# Altium project M2.PrjPcb
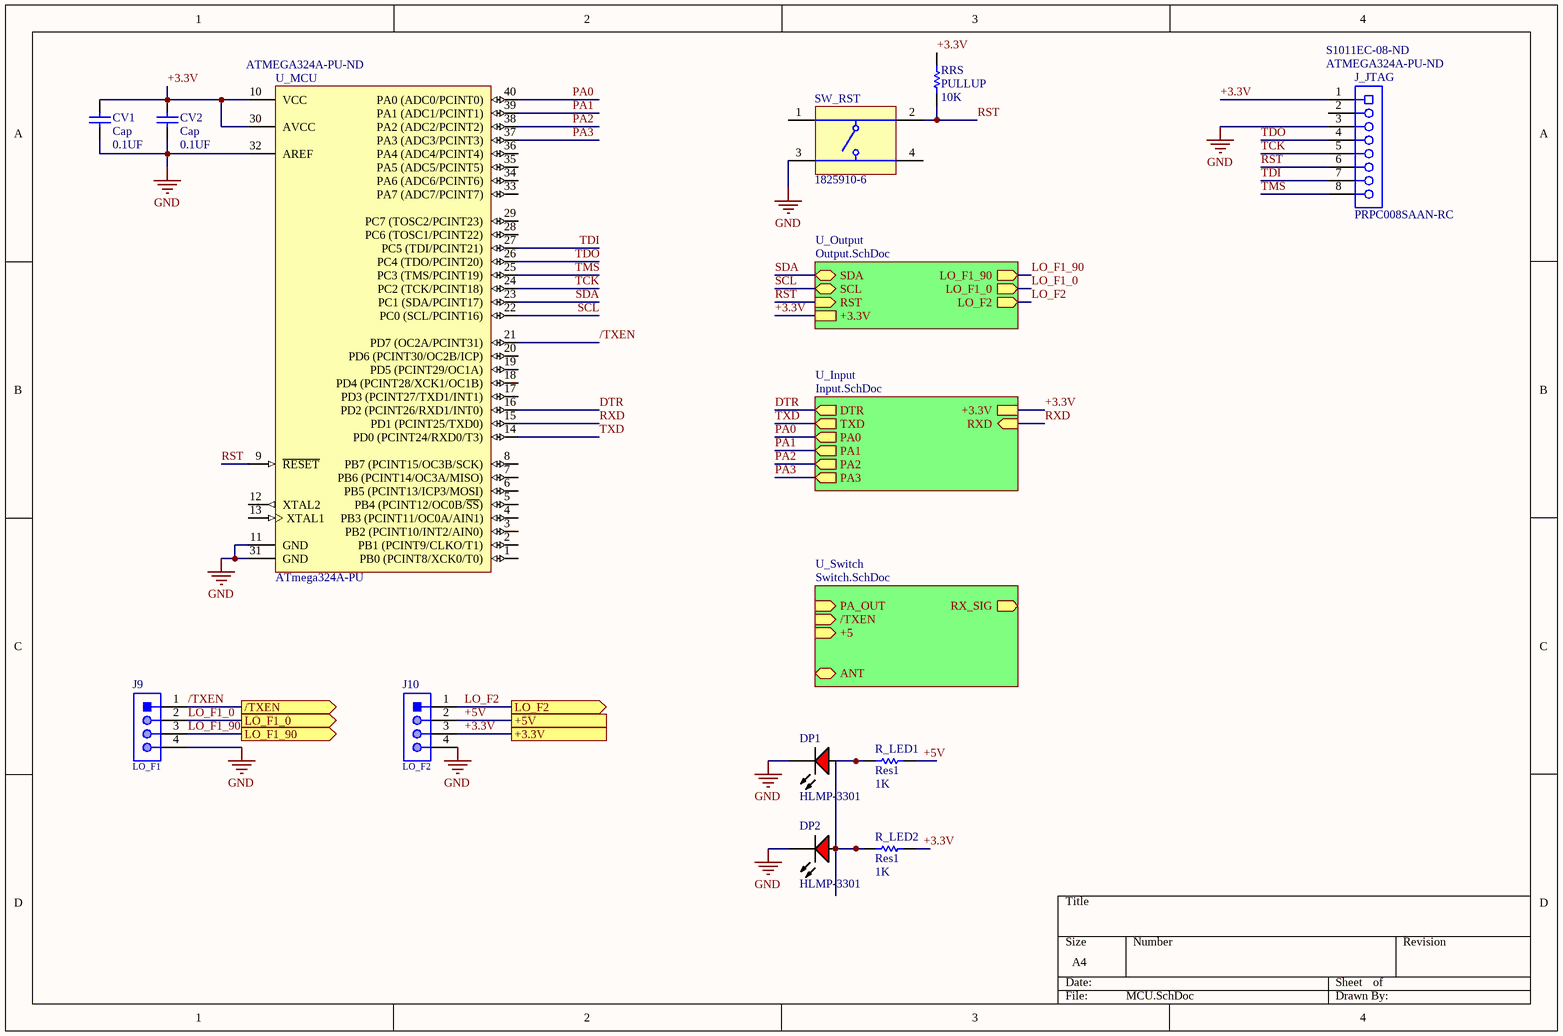
[diagram p0: MCU.SchDoc]
4 sheets, 38 parts. Net scope: hierarchical (ports join the sheet entries above them; power ports are global).
Sheets:
  MCU.SchDoc
    U_Output = Output.SchDoc
    U_Switch = Switch.SchDoc
    U_Input = Input.SchDoc

## Sheet MCU.SchDoc
size A4; SheetNumber: 1; SheetTotal: 4

### Parts
CV1  Cap  value 0.1UF  [1206]
CV2  Cap  value 0.1UF  [1206]
DP1  HLMP-3301  [AVAG-HLMP-3301-2]
DP2  HLMP-3301  [AVAG-HLMP-3301-2]
J9  LO_F1  [61300411121]
J10  LO_F2  [61300411121]
J_JTAG  PRPC008SAAN-RC  Supplier Part Number 1: ATMEGA324A-PU-ND  Supplier Part Number 2: S1011EC-08-ND  [SLIN-PPPC081LFBN-RC_V]
R_LED1  Res1  value 1K  [AXIAL-0.1-RES]
R_LED2  Res1  value 1K  [AXIAL-0.1-RES]
RRS  PULLUP  value 10K  [AXIAL-0.1-RES]
SW_RST  1825910-6  [TECO-1825910-6_V]
U_MCU  ATmega324A-PU  Supplier Part Number 1: ATMEGA324A-PU-ND  [40P6]

### Sub-sheets
U_Input = Input.SchDoc: +3.3V, DTR (out), RXD (in), TXD (out), PA0 (out), PA1 (out), PA2 (out), PA3 (out)
U_Output = Output.SchDoc: SDA (bidir), SCL (bidir), RST (in), LO_F1_90 (out), LO_F1_0 (out), LO_F2 (out), +3.3V
U_Switch = Switch.SchDoc: PA_OUT (in), ANT (bidir), /TXEN (in), +5 (in), RX_SIG (out)

### Ports
+3.3V, +5V, /TXEN (out), LO_F1_0 (out), LO_F1_90 (out), LO_F2 (out)

### Nets
GND: CV1.1 CV2.1 DP1.1(K) DP2.1(K) J9.4 J10.4 J_JTAG.3 SW_RST.3 U_MCU.11(GND) U_MCU.31(GND) U_MCU.32(AREF)
+3.3V: CV1.2 CV2.2 J10.3 J_JTAG.1 R_LED2.2 RRS.2 U_MCU.10(VCC) U_MCU.30(AVCC) ; port +3.3V, sheet U_Output/+3.3V, sheet U_Input/+3.3V
+5V: J10.2 R_LED1.2 ; port +5V
/TXEN: J9.1 U_MCU.21(PD7_(OC2A/PCINT31)) ; port /TXEN
DTR: U_MCU.16(PD2_(PCINT26/RXD1/INT0)) ; sheet U_Input/DTR
LO_F1_0: J9.2 ; port LO_F1_0, sheet U_Output/LO_F1_0
LO_F1_90: J9.3 ; port LO_F1_90, sheet U_Output/LO_F1_90
LO_F2: J10.1 ; port LO_F2, sheet U_Output/LO_F2
PA0: U_MCU.40(PA0_(ADC0/PCINT0)) ; sheet U_Input/PA0
PA1: U_MCU.39(PA1_(ADC1/PCINT1)) ; sheet U_Input/PA1
PA2: U_MCU.38(PA2_(ADC2/PCINT2)) ; sheet U_Input/PA2
PA3: U_MCU.37(PA3_(ADC3/PCINT3)) ; sheet U_Input/PA3
RST: J_JTAG.6 RRS.1 SW_RST.2 U_MCU.9(~{RESET}) ; sheet U_Output/RST
RXD: U_MCU.15(PD1_(PCINT25/TXD0)) ; sheet U_Input/RXD
SCL: U_MCU.22(PC0_(SCL/PCINT16)) ; sheet U_Output/SCL
SDA: U_MCU.23(PC1_(SDA/PCINT17)) ; sheet U_Output/SDA
TCK: J_JTAG.5 U_MCU.24(PC2_(TCK/PCINT18))
TDI: J_JTAG.7 U_MCU.27(PC5_(TDI/PCINT21))
TDO: J_JTAG.4 U_MCU.26(PC4_(TDO/PCINT20))
TMS: J_JTAG.8 U_MCU.25(PC3_(TMS/PCINT19))
TXD: U_MCU.14(PD0_(PCINT24/RXD0/T3)) ; sheet U_Input/TXD
NetDP1_2: DP1.2(A) DP2.2(A) R_LED1.1 R_LED2.1

Not connected (* = marked no-connect by the designer): J_JTAG 2; SW_RST 1 4; U_MCU 1(PB0_(PCINT8/XCK0/T0)) 2(PB1_(PCINT9/CLKO/T1)) 3(PB2_(PCINT10/INT2/AIN0)) 4(PB3_(PCINT11/OC0A/AIN1)) 5(PB4_(PCINT12/OC0B/~{SS})) 6(PB5_(PCINT13/ICP3/MOSI)) 7(PB6_(PCINT14/OC3A/MISO)) 8(PB7_(PCINT15/OC3B/SCK)) 12(XTAL2) 13(XTAL1) 17(PD3_(PCINT27/TXD1/INT1)) 18(PD4_(PCINT28/XCK1/OC1B)) 19(PD5_(PCINT29/OC1A)) 20(PD6_(PCINT30/OC2B/ICP)) 28(PC6_(TOSC1/PCINT22)) 29(PC7_(TOSC2/PCINT23)) 33(PA7_(ADC7/PCINT7)) 34(PA6_(ADC6/PCINT6)) 35(PA5_(ADC5/PCINT5)) 36(PA4_(ADC4/PCINT4))

### Library data of the parts
CV1 CV2 = CAP CER 0.1UF 50V X7R 1206: Capacitor; Manufacturer Part Number: 885012208087; Designator: C?; Voltage Rating: 50V; Published: 8-Jun-2000; LatestRevisionDate: 17-Jul-2002; LatestRevisionNote: Re-released for DXP Platform.; Publisher: Altium Limited
DP1 DP2 = CMP-2000-06411-1: T-1 3/4 (5 mm) Diffused LED Lamp, 1.9 V, -40 to 100 degC, 2-Pin THD, RoHS, Bulk; Manufacturer: Avago; Forward Current: 25mA; Forward Voltage: 2.4V; Peak Wavelength: 635nm; Shape Type: Circular; High Brightness: No; Main Category: StandardLED; Test Current (It): 10mA; Dominant Wave Length: 626nm; Number of  Elements: 1; Reverse Voltage: 5V; Chip Material: GaP; Product Height (mm): 9.19mm; Lens Type: ColoredDiffused; Viewing Angle: 60deg; Emitting Color: Red; Luminous Intensity: 5.4mcd; Power Dissipation: 85W; DELETED: Compliant; Product Depth (mm): 6.1mm; Package Description: 2-Pin Through Hole LED, Dia 5.85 mm; Mounting Technology: ThroughHole; Manufacturer URL: http://www.avagotech.com/; Package Type: T-13/4; Operating Temp Range: -40Cto100C; Datasheet URL: http://www.avagotech.com/docs/AV02-1558EN; Mounting: ThroughHole; Lens Dimensions: 5.08x5.08x8.3mm; Package Reference: HLMP-3301; Datasheet Version: 03/2015; Pin Count: 2; Packaging: TapeandReel; Type: Uni-Color; Operating Temperature Classification: Industrial; Lum Intensity: 5.4mcd; Rad Hardened: No; Product Length (mm): 6.1mm
J9 J10 = CMP-1502-01064-1: THT Vertical Pin Header WR-PHD, Pitch 2.54 mm, Single Row, 4 pins; Manufacturer: Wurth Elektronik; Withstanding Voltage: 500VAC; Rated Current: 3A; Working Voltage: 250VAC; Pin Number: 4; Gender: Male; Contact Resistance: 20mOhm; Pitch: 2.54mm; Manufacturer URL: http://www.we-online.de; Operating Temperature: -40to105degC; Packaging: Bag; Mounting Technology: THT; Package Reference: 61300411121; Datasheet URL: https://katalog.we-online.de/em/datasheet/6130xx11121.pdf; Publisher: WurthElektronik; Part Number: 61300411121; Row Number: Single; Orientation: Vertical
J_JTAG = CMP-1770-00002-1: Female Header, Pitch 2.54 mm, 1 x 8 Position, Height 8.5 mm, Tail Length 3.2 mm, -40 to 105 degC, RoHS, Bulk; Manufacturer: Microchip; Manufacturer Part Number: ATMEGA324A-PU; Manufacturer Series: PRP; Case\Package: TO-252-3; Rds On Max: 115 mohm; Typical Rise Time: 90 ns; Max Power Dissipation: 2.5 W; Input Capacitance: 350 pF; Elements: 1; Package Body Material: Plastic; Max Frequency: 20MHz; Number of I/O Lines: 32; Package Equivalence Code: DIP40,.6; Power Supplies: 2.5V; Speed: 20RPM; Max Supply Current: 12mA; Max Supply Voltage: 5.5V; Min Supply Voltage: 4.5V; Supply Voltage-Nom: 5V; Surface Mount: No; Qualification Status: Not Qualified; Connector Type: BOARD CONNECTOR; Contact Pattern: RECTANGULAR; Contact Style: SQ PIN-SKT; Rated Current (Signal): 3A; Number of Contacts: 8; Body Breadth: 0.1inch; Body Length: 0.8inch; Reference Standard: UL; Reliability: COMMERCIAL; Height: 2.39 mm; Min Operating Temperature: -55 degC; RoHSCompliant: true; PackageDescription: Female Header, Pitch 2.54 mm, 1 x 8 Position, Height 8.5 mm, Tail Length 3.2 mm; Length: 6.73 mm; ComponentLink1Description: Datasheet; Package Quantity: 2500; Max Operating Temperature: 150 degC; Width: 6.22 mm; Radiation Hardening: No; Packaging: Tape and Reel; REACH SVHC: No SVHC; Pins: 3; PackageReference: PPPC081LFBN-RC; ComponentLink1URL: http://sullinscorp.com/catalogs/101_PAGE114-115_.100_FEMALE_HDR.pdf; DatasheetVersion: Jan-15; Mount: Surface Mount; Supplier 1: Digikey; RoHS: Yes; Category: Uncategorized; Stock 1: 23; Pricing 1: 1=4.89 (USD); Package Code: DIP; Number of Pins: 40; Package Shape: Rectangular; JESD-30 Code: R-PDIP-T40; Package Style: IN-LINEMeter; Technology: CMOS; Terminal Form: Through Hole; Terminal Position: DUAL; Height - Seated (Max): 4.826mm; Terminal Pitch: 2.54mm; Reach SVHC Compliant: Yes; RoHS Compliant: Yes; Temperature Grade: INDUSTRIAL; ComponentLink2URL: https://datasheet.ciiva.com:443/pdfs/VipMasterIC/IC/ATML/ATML-S-A0002523532/ATML-S-A0002523532-1.pdf?src-supplier=IHS+Markit; ComponentLink2Description: https://datasheet.ciiva.com:443/pdfs/VipMasterIC/IC/ATML/ATML-S-A0002523532/ATML-S-A0002523532-1.pdf?src-supplier=IHS+Markit; ComponentLink3URL: https://datasheet.ciiva.com/26860/getdatasheetpartid-472561-26860352.pdf?src-supplier=Verical; ComponentLink3Description: https://datasheet.ciiva.com/26860/getdatasheetpartid-472561-26860352.pdf?src-supplier=Verical; ComponentLink4URL: https://datasheet.ciiva.com/1157/1712449-1157578.pdf?src-supplier=Element14; ComponentLink4Description: https://datasheet.ciiva.com/1157/1712449-1157578.pdf?src-supplier=Element14; ComponentLink5URL: https://datasheet.ciiva.com/3203/doc8272-3203814.pdf?src-supplier=Avnet; ComponentLink5Description: https://datasheet.ciiva.com/3203/doc8272-3203814.pdf?src-supplier=Avnet; Supplier 2: Digikey; Stock 2: 5315; Pricing 2: 1=0.21, 10=0.175, 100=0.1343, 500=0.11364, 1000=0.09297, 5000=0.08264, 10000=0.0749 (USD); Contact Material: Brass; Contact Finish - Mating: AU ON NI; Contact Finish - Termination: Gold (Au) - with Nickel (Ni) barrier; Insulation Material: Polybutylene; JESD-609 Code: e4; Contact Gender: Male; Mounting Style: STRAIGHT; Number Of Connectors: 1; Number Of PCB Rows: 1; Number of Rows Loaded: 1; PCB Contact Pattern: RECTANGULAR; Termination: Solder; Body Depth: 0.1inch; Mating Contact Pitch: 0.1inch; Terminal Length: 0.12inch; ComponentLink6URL: https://datasheet.ciiva.com:443/pdfs/VipMasterIC/IC/SUCS/SUCSS00322/SUCSS00322-1.pdf?src-supplier=IHS+Markit; ComponentLink6Description: https://datasheet.ciiva.com:443/pdfs/VipMasterIC/IC/SUCS/SUCSS00322/SUCSS00322-1.pdf?src-supplier=IHS+Markit; ComponentLink7URL: https://datasheet.ciiva.com/741/xrxczzzsxxn-rc-st-11635-b-741237.pdf?src-supplier=Digikey; ComponentLink7Description: https://datasheet.ciiva.com/741/xrxczzzsxxn-rc-st-11635-b-741237.pdf?src-supplier=Digikey
R_LED1 R_LED2 = RES 1K OHM 5% 1/4W AXIAL: Resistor; Manufacturer Part Number: CFR-25JB-52-1K; Designator: R?; Power Rating: 1/4W; Tolerance: 0.05; Published: 8-Jun-2000; LatestRevisionDate: 17-Jul-2002; LatestRevisionNote: Re-released for DXP Platform.; Publisher: Altium Limited
RRS = RES 10K OHM 5% 1/4W AXIAL: Resistor; Manufacturer Part Number: CFR-25JB-52-10K; Designator: R?; Power Rating: 1/4W; Tolerance: 0.05; Published: 8-Jun-2000; LatestRevisionDate: 17-Jul-2002; LatestRevisionNote: Re-released for DXP Platform.; Publisher: Altium Limited
SW_RST = CMP-1684-00021-1: Tact Switch, SPST-NO, 0.05 A, -35 to 85 degC, 4-Pin THD, RoHS, Bulk; Manufacturer: TE Connectivity; Maximum Contact Resistance: 100mOhm; Mechanical Life: 100000Cycles; Bushing Type: Unthreaded; Switch Configuration: OFF(ON); Maximum DC Voltage Rating: 24V; Contact Rating @ Voltage: 0.05A@24VDC; Actuator Color: Black; Body Orientation: Straight; Function: MomentaryContact; Illumination: N/R; Actuator Style: RoundButton; Actuator Material: PolybutyleneTerephthalate; Dielectric Strength: 500VAC; Pole Throw Configuration: SPST; Actuator Length: 1.4mm; Product Weight: N/A; Contact Material: CopperAlloy; Housing Material: N/A; Terminal Type: PCPins; Minimum Insulation Resistance: 100MOhm; Package Description: 4-Pin Through Hole Device, Body 5.99 x 5.99 mm, Pitch 6.5 mm; Part No: 1825910-6; Package Reference: THD; Base Material: N/A; Manufacturer URL: http://www.te.com; Contact Plating: Silver; RoHS: Yes; Datasheet Version: Rev. C9; Electrical Life: 100000Cycles; Maximum AC Voltage Rating: N/A; Thread Size: N/R; Operating Temperature: -35to85C; Mounting: ThroughHole; Dimension: 5.99x5mm; Datasheet URL: http://www.te.com/commerce/DocumentDelivery/DDEController?Action=showdoc&DocId=Customer+Drawing%7F1825910%7FC9%7Fpdf%7FEnglish%7FENG_CD_1825910_C9.pdf%7F1825910-6; Family: 1825910; Seal Location: N/A; Seal Description: N/A; Packaging: N/A
U_MCU = CMP-0095-00016-2: 8-bit AVR Microcontroller, 32KB Flash, 1KB EEPROM, 2KB SRAM, 40-pin PDIP, Industrial Grade (-40°C to 85°C); Manufacturer: Microchip; Package Body Material: Plastic; Max Frequency: 20MHz; Number of I/O Lines: 32; Package Equivalence Code: DIP40,.6; Power Supplies: 2.5V; Speed: 20RPM; Max Supply Current: 12mA; Max Supply Voltage: 5.5V; Min Supply Voltage: 4.5V; Supply Voltage-Nom: 5V; Surface Mount: No; Qualification Status: Not Qualified; ComponentLink2URL: http://www.atmel.com/dyn/resources/prod_documents/doc8272.pdf; RevisionNote: DatasheetVersion & Sch pin names updated. URLs added.; PackageReference: 40P6; PackageDescription: 40-lead (0.600"/15.24mm Wide) Plastic Dual Inline Package (PDIP); ComponentLink3Description: ATmega164A/164PA/324A/324PA/644A/644PA/1284/1284P Summary; ComponentLink3URL: http://www.atmel.com/dyn/resources/prod_documents/8272S.pdf; Code_JEDEC: MS-011-AC; ComponentLink1URL: http://www.atmel.com/; PackageVersion: revB, Sep-2001; DatasheetVersion: revC, Jun-2011; ComponentLink2Description: ATmega164A/164PA/324A/324PA/644A/644PA/1284/1284P Datasheet; ComponentLink1Description: Manufacturer URL; Supplier 1: Digikey; Manufacturer Part Number: ATMEGA324A-PU; RoHS: Yes; Category: Uncategorized; Stock 1: 23; Pricing 1: 1=4.89 (USD); Package Code: DIP; Number of Pins: 40; Package Shape: Rectangular; Min Operating Temperature: -40°C; Max Operating Temperature: 85°C; JESD-30 Code: R-PDIP-T40; Package Style: IN-LINEMeter; Technology: CMOS; Terminal Form: Through Hole; Terminal Position: DUAL; Length: 52.324mm; Width: 15.24mm; Height - Seated (Max): 4.826mm; Terminal Pitch: 2.54mm; Reach SVHC Compliant: Yes; RoHS Compliant: Yes; Temperature Grade: INDUSTRIAL; ComponentLink4URL: https://datasheet.ciiva.com:443/pdfs/VipMasterIC/IC/ATML/ATML-S-A0002523532/ATML-S-A0002523532-1.pdf?src-supplier=IHS+Markit; ComponentLink4Description: https://datasheet.ciiva.com:443/pdfs/VipMasterIC/IC/ATML/ATML-S-A0002523532/ATML-S-A0002523532-1.pdf?src-supplier=IHS+Markit; ComponentLink5URL: https://datasheet.ciiva.com/26860/getdatasheetpartid-472561-26860352.pdf?src-supplier=Verical; ComponentLink5Description: https://datasheet.ciiva.com/26860/getdatasheetpartid-472561-26860352.pdf?src-supplier=Verical; ComponentLink6URL: https://datasheet.ciiva.com/1157/1712449-1157578.pdf?src-supplier=Element14; ComponentLink6Description: https://datasheet.ciiva.com/1157/1712449-1157578.pdf?src-supplier=Element14; ComponentLink7URL: https://datasheet.ciiva.com/3203/doc8272-3203814.pdf?src-supplier=Avnet; ComponentLink7Description: https://datasheet.ciiva.com/3203/doc8272-3203814.pdf?src-supplier=Avnet

## Sheet Output.SchDoc
size A4; SheetNumber: 3; SheetTotal: 4
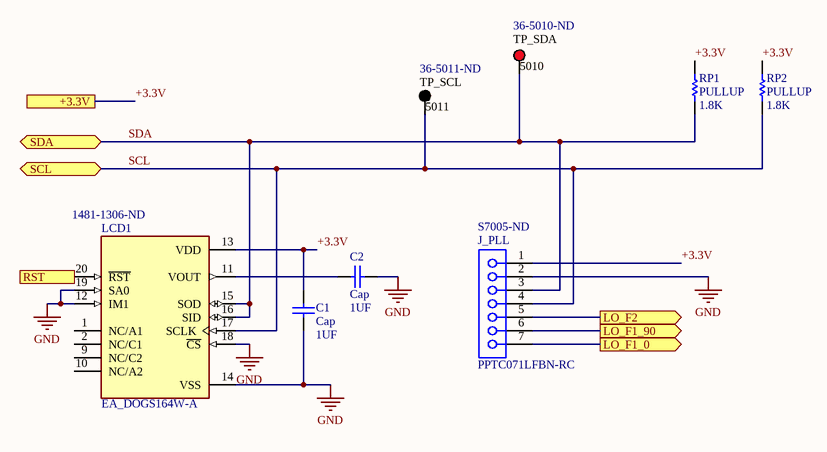
[diagram p1: Output.SchDoc]

### Parts
C1  Cap  value 1UF  [RADIAL-0.1]
C2  Cap  value 1UF  [RADIAL-0.1]
J_PLL  PPTC071LFBN-RC  Supplier Part Number 1: S7005-ND  [SMTC-SSQ-107-01-X-S]
LCD1  EA_DOGS164W-A  Supplier Part Number 1: 1481-1306-ND  [LCD_EA_DOGS164W-A]
RP1  PULLUP  value 1.8K  [AXIAL-0.1-RES]
RP2  PULLUP  value 1.8K  [AXIAL-0.1-RES]
TP_SCL  5011  Supplier Part Number 1: 36-5011-ND  [KSTN-5011_V]
TP_SDA  5010  Supplier Part Number 1: 36-5010-ND  [KSTN-5010_V]

### Ports
+3.3V, LO_F1_0 (out), LO_F1_90 (out), LO_F2 (out), RST (in), SCL (bidir), SDA (bidir)

### Nets
GND: C1.1 C2.1 J_PLL.2 LCD1.12(IM1) LCD1.14(VSS) LCD1.18(~{CS}) LCD1.19(SA0)
+3.3V: C1.2 J_PLL.1 LCD1.13(VDD) RP1.2 RP2.2 ; port +3.3V
LO_F1_0: J_PLL.7 ; port LO_F1_0
LO_F1_90: J_PLL.6 ; port LO_F1_90
LO_F2: J_PLL.5 ; port LO_F2
RST: LCD1.20(~{RST}) ; port RST
SCL: J_PLL.4 LCD1.17(SCLK) RP2.1 TP_SCL.1 ; port SCL
SDA: J_PLL.3 LCD1.15(SOD) LCD1.16(SID) RP1.1 TP_SDA.1 ; port SDA
NetC2_2: C2.2 LCD1.11(VOUT)

Not connected (* = marked no-connect by the designer): LCD1 1(NC/A1) 2(NC/C1) 9(NC/C2) 10(NC/A2)

### Library data of the parts
C1 C2 = CAP ALUM 1UF 20% 100V RADIAL: Capacitor; Manufacturer Part Number: ESE105M100AC3EA; Designator: C?; Voltage Rating: 100V; Published: 8-Jun-2000; LatestRevisionDate: 17-Jul-2002; LatestRevisionNote: Re-released for DXP Platform.; Publisher: Altium Limited
J_PLL = CMP-1023-00284-1: SQ Post Socket, Through-hole, Vertical, -55 to 125 degC, 2.54 mm Pitch, 7-Pin, Female, RoHS; PartNumber: SSQ-107-01-G-S; Manufacturer: Samtec; Manufacturer Series: PP; Pitch: 2.54 mm; Description: Board Connector, 7 Contact(s), 1 Row(s), Female, Straight, 0.1 inch Pitch, Solder Terminal, Locking; Connector Type: BOARD CONNECTOR; Contact Pattern: RECTANGULAR; Contact Style: SQ PIN-SKT; Number Of Connectors: 1; Polarization Key: POLARIZED HOUSING; Rated Current (Signal): 3A; Number of Contacts: 7; Body Breadth: 0.094inch; Body Depth: 0.334inch; Body Length: 0.72inch; Mating Contact Pitch: 0.1inch; Mounting Option 1: LOCKING; Reference Standard: UL; Reliability: COMMERCIAL; PackageDescription: Assembly, Socket Strip .025[0.64] SQ Tail; PackageReference: SSQ-107-01-X-S; ComponentLink2URL: http://www.samtec.com/documents/webfiles/pdf/SSQ_TH.PDF; ComponentLink1URL: http://www.samtec.com; ComponentLink3Description: Package Specification; PackageVersion: BD, 6/1987; RoHS: True; DatasheetVersion: F-214; Mounting Technology: Through-hole; ComponentLink3URL: http://www.samtec.com/documents/webfiles/cpdf/SSQ-1XX-XX-XXX-X-XX-XXX-XX-X-MKT.pdf; ComponentLink1Description: Manufacturer URL; Temperature Range: -55 to 125 degC; Orientation: Vertical; ComponentLink2Description: Datasheet; Supplier 1: Digikey; Manufacturer Part Number: PPTC071LFBN-RC; Category: Connectors; Stock 1: 11503; Pricing 1: 1=0.6, 10=0.52, 80=0.42913, 440=0.37309, 1000=0.30781, 5000=0.2705, 10000=0.2665 (USD); Mount: Board; Contact Material: Bronze; Contact Finish - Mating: SN; Contact Finish - Termination: TIN; Insulation Material: Polyester; Contact Gender: Female; Mounting Style: STRAIGHT; Number Of PCB Rows: 1; Number of Rows Loaded: 1; PCB Contact Pattern: RECTANGULAR; Termination: Solder; Terminal Length: 0.125inch; Terminal Pitch: 2.54mm; Reach SVHC Compliant: Yes; RoHS Compliant: Yes; ComponentLink4URL: https://datasheet.ciiva.com:443/pdfs/VipMasterIC/IC/SUCS/SUCSS00270/SUCSS00270-1.pdf?src-supplier=IHS+Markit; ComponentLink4Description: https://datasheet.ciiva.com:443/pdfs/VipMasterIC/IC/SUCS/SUCSS00270/SUCSS00270-1.pdf?src-supplier=IHS+Markit; ComponentLink5URL: https://media.digikey.com/pdf/Data%20Sheets/Sullins%20PDFs/Female_Headers.100_DS.pdf?src-supplier=Digikey; ComponentLink5Description: https://media.digikey.com/pdf/Data%20Sheets/Sullins%20PDFs/Female_Headers.100_DS.pdf?src-supplier=Digikey; ComponentLink6URL: http://www.sullinscorp.com/catalogs/78_Page80-81_HEADER_.100_2.54mm_FEMALE.pdf?src-supplier=Future+Electronics; ComponentLink6Description: http://www.sullinscorp.com/catalogs/78_Page80-81_HEADER_.100_2.54mm_FEMALE.pdf?src-supplier=Future+Electronics
LCD1 = EA_DOGS164W-A: LCM char. 4x16 FSTN White Transflective EA DOGS164W-A; MF: Display Visions; Value: *; Check_prices: https://www.snapeda.com/parts/EA%20DOGS164W-A/Focus+Display+Solutions/view-part/?ref=eda; Price: None; MP: EA DOGS164W-A; SnapEDA_Link: https://www.snapeda.com/parts/EA%20DOGS164W-A/Focus+Display+Solutions/view-part/?ref=snap; Purchase-URL: https://pricing.snapeda.com/search/part/EA DOGS164W-A/?ref=eda; Package: None; Availability: In Stock; Supplier 1: Digikey; Manufacturer: Display Visions; Manufacturer Part Number: EADOGS164W-A; RoHS: No; Category: Uncategorized; Stock 1: 178; Pricing 1: 1=8.31, 10=6.026, 100=4.9791, 500=4.36068, 1000=4.12282, 2000=4.02768 (USD)
RP1 RP2 = RES 1.8K OHM 5% 1/4W AXIAL: Resistor; Manufacturer Part Number: CFR-25JB-52-1K8; Designator: R?; Power Rating: 1/4W; Tolerance: 0.05; Published: 8-Jun-2000; LatestRevisionDate: 17-Jul-2002; LatestRevisionNote: Re-released for DXP Platform.; Publisher: Altium Limited
TP_SCL = CMP-1672-00003-4: Test Point, Black, Through Hole, RoHS, Bulk; Manufacturer: Keystone; Description: Interconnection Device; ComponentLink2URL: http://www.keyelco.com/product-pdf.cfm?p=1320; Colour: Black; Pins: 1; REACH SVHC: No SVHC; ComponentLink1URL: http://www.keyelco.com/; PackageReference: 5011; Contact Plating: Silver; Package Quantity: 100; Packaging: Bulk; RoHSCompliant: true; Height: 8.12 mm; PackageDescription: 1-Pin Through Hole Device, Dia 3.17 mm; Mount: Through Hole; Mounting Technology: Through Hole; DatasheetVersion: Rev. F, 12/2013; ComponentLink1Description: Manufacturer URL; Contact Material: Bronze; ComponentLink2Description: Datasheet; Supplier 1: Digikey; Manufacturer Part Number: 5011; RoHS: Yes; Category: Connectors; Stock 1: 173174; Pricing 1: 1=0.38, 25=0.308, 100=0.3015, 250=0.28304, 500=0.2523, 1000=0.17746, 2500=0.16225, 5000=0.15211 (USD); Connector Type: Interconnection Device; Reach SVHC Compliant: Yes; RoHS Compliant: Yes; ComponentLink3URL: https://datasheet.ciiva.com:443/pdfs/VipMasterIC/IC/KEYC/KEYC-S-A0000709140/KEYC-S-A0000709140-1.pdf?src-supplier=IHS+Markit; ComponentLink3Description: https://datasheet.ciiva.com:443/pdfs/VipMasterIC/IC/KEYC/KEYC-S-A0000709140/KEYC-S-A0000709140-1.pdf?src-supplier=IHS+Markit; ComponentLink4URL: https://datasheet.ciiva.com/1454/1718230-1454834.pdf?src-supplier=Element14; ComponentLink4Description: https://datasheet.ciiva.com/1454/1718230-1454834.pdf?src-supplier=Element14; ComponentLink5URL: https://datasheet.ciiva.com/11744/0900766b8009b7c7-11744935.pdf?src-supplier=Rs; ComponentLink5Description: https://datasheet.ciiva.com/11744/0900766b8009b7c7-11744935.pdf?src-supplier=Rs; ComponentLink6URL: https://datasheet.ciiva.com/2917/5011-2917635.pdf?src-supplier=Digikey; ComponentLink6Description: https://datasheet.ciiva.com/2917/5011-2917635.pdf?src-supplier=Digikey; ComponentLink7URL: https://datasheet.ciiva.com/16351/m60-2p60-16351093.pdf?src-supplier=Future+Electronics; ComponentLink7Description: https://datasheet.ciiva.com/16351/m60-2p60-16351093.pdf?src-supplier=Future+Electronics; ComponentLink8URL: https://datasheet.ciiva.com/46412/1703983-46412138.pdf?src-supplier=Element14; ComponentLink8Description: https://datasheet.ciiva.com/46412/1703983-46412138.pdf?src-supplier=Element14
TP_SDA = CMP-1672-00002-4: Test Point, Red, Through Hole, RoHS, Bulk; Manufacturer: Keystone; Description: Interconnection Device; Contact Material: Bronze; Mounting Technology: Through Hole; RoHSCompliant: true; Pins: 1; Package Quantity: 100; ComponentLink2Description: Datasheet; Height: 8.12 mm; ComponentLink1URL: http://www.keyelco.com/; DatasheetVersion: Rev. F, 12/2013; Mount: Through Hole; PackageReference: 5010; Contact Plating: Silver; Packaging: Bulk; Colour: Red; REACH SVHC: No SVHC; PackageDescription: 1-Pin Through Hole Device, Dia 3.17 mm; ComponentLink2URL: http://www.keyelco.com/product-pdf.cfm?p=1319; ComponentLink1Description: Manufacturer URL; Supplier 1: Digikey; Manufacturer Part Number: 5010; RoHS: Yes; Category: Connectors; Stock 1: 226312; Pricing 1: 1=0.38, 25=0.308, 100=0.3015, 250=0.28304, 500=0.2523, 1000=0.17746, 2500=0.16225, 5000=0.15211 (USD); Contact Finish - Termination: Silver (Ag); Connector Type: Interconnection Device; JESD-609 Code: e4; Reach SVHC Compliant: Yes; RoHS Compliant: Yes; ComponentLink3URL: https://datasheet.ciiva.com:443/pdfs/VipMasterIC/IC/KEYC/KEYC-S-A0000709033/KEYC-S-A0000709033-1.pdf?src-supplier=IHS+Markit; ComponentLink3Description: https://datasheet.ciiva.com:443/pdfs/VipMasterIC/IC/KEYC/KEYC-S-A0000709033/KEYC-S-A0000709033-1.pdf?src-supplier=IHS+Markit; ComponentLink4URL: https://datasheet.ciiva.com/11744/0900766b8009b7c7-11744920.pdf?src-supplier=Rs; ComponentLink4Description: https://datasheet.ciiva.com/11744/0900766b8009b7c7-11744920.pdf?src-supplier=Rs; ComponentLink5URL: https://datasheet.ciiva.com/1454/1703983-1454833.pdf?src-supplier=Element14; ComponentLink5Description: https://datasheet.ciiva.com/1454/1703983-1454833.pdf?src-supplier=Element14; ComponentLink6URL: https://datasheet.ciiva.com/22631/1703983-22631113.pdf?src-supplier=Element14; ComponentLink6Description: https://datasheet.ciiva.com/22631/1703983-22631113.pdf?src-supplier=Element14; ComponentLink7URL: https://datasheet.ciiva.com/16883/70182825-16883886.pdf?src-supplier=Allied+Electronics; ComponentLink7Description: https://datasheet.ciiva.com/16883/70182825-16883886.pdf?src-supplier=Allied+Electronics; ComponentLink8URL: https://datasheet.ciiva.com/16506/m60-2p60-16506972.pdf?src-supplier=Future+Electronics; ComponentLink8Description: https://datasheet.ciiva.com/16506/m60-2p60-16506972.pdf?src-supplier=Future+Electronics; ComponentLink9URL: https://datasheet.ciiva.com/2917/5010-2917626.pdf?src-supplier=Digikey; ComponentLink9Description: https://datasheet.ciiva.com/2917/5010-2917626.pdf?src-supplier=Digikey

## Sheet Switch.SchDoc
size A; SheetNumber: 4; SheetTotal: 4
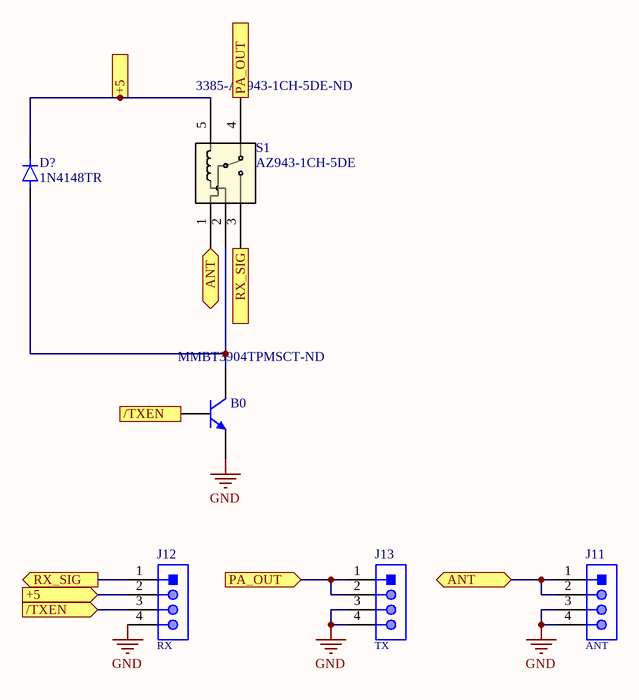
[diagram p2: Switch.SchDoc]

### Parts
B0  Supplier Part Number 1: MMBT3904TPMSCT-ND  (hidden comment: Bipolar NPN 3 Pins Transistor VBIC Model)
D?  1N4148TR  [DIOAD753W49L380D172B]
J11  ANT  [61300411121]
J12  RX  [61300411121]
J13  TX  [61300411121]
S1  AZ943-1CH-5DE  Supplier Part Number 1: 3385-AZ943-1CH-5DE-ND  [K_AZ943-1C_AMZ]

### Ports
+5 (in), /TXEN (in), ANT (bidir), PA_OUT (in), RX_SIG (out)

### Nets
GND: B0.3(E) J11.3 J11.4 J12.4 J13.3 J13.4
NetB0_1: B0.1(C) D?.A S1.2
NetB0_2: B0.2(B) J12.3 ; port /TXEN
NetD?_K: D?.K J12.2 S1.5 ; port +5
NetJ11_1: J11.1 J11.2 S1.1 ; port ANT
NetJ12_1: J12.1 S1.3 ; port RX_SIG
NetJ13_1: J13.1 J13.2 S1.4 ; port PA_OUT

### Library data of the parts
B0 = BJT NPN VBIC: Small Signal Bipolar Transistor, 0.2A I(C), 40V V(BR)CEO, 1-Element, NPN, Silicon; Manufacturer: MCC; Manufacturer Part Number: MMBT3904-TP; SimulationGenericComponent: True; AFN: 1; AJC: -0.5; ART: 0.1; AVC1: 0; EA: 1.12; FC: 0.9; IBBE: 1e-06; IBCI: 1e-16; IBEI: 1e-18; MC: 0.33; NCN: 2; NKF: 0.5; PC: 0.75; TNOM: 27; VERS: 1.2; XII: 3; Package Body Material: Plastic; Max Collector Current: 200mA; DC Current Gain-Min (hFE): 30; Power Dissipation-Max (Abs): 350mW; Time @ Peak Reflow Temperature-Max (s): 10s; Transistor Application: AMPLIFIER; Transition Frequency-Nom (fT): 300MHz; Turn-off Time-Max (toff): 250ns; Turn-on Time-Max (ton): 70ns; Qualification Status: Not Qualified; AJE: -0.5; AJS: -0.5; AVC2: 0; BFN: 1; CBCO: 0; CBEO: 0; CCSO: 0; CJC: 0; CJCP: 0; CJE: 0; CJEP: 0; CTH: 0; DEAR: 0; EAIC: 1.12; EAIE: 1.12; EAIS: 1.12; EANC: 1.12; EANE: 1.12; EANS: 1.12; EAP: 1.12; EBBE: 0; GAMM: 0; HRCF: 1; IBCIP: 0; IBCN: 0; IBCNP: 0; IBEIP: 0; IBEN: 0; IBENP: 0; IKF: 0; IKP: 0; IKR: 0; IS: 1e-16; ISP: 0; ISRR: 1; ITF: 0; KFN: 0; ME: 0.33; MS: 0.33; NBBE: 1; NCI: 1; NCIP: 1; NCNP: 2; NEI: 1; NEN: 2; NF: 1; NFP: 1; NR: 1; PE: 0.75; PS: 0.75; QBM: 0; QCO: 0; QTF: 0; RBI: 0.1; RBP: 0.1; RBX: 0; RCI: 0.1; RCX: 0; RE: 0; RS: 0; RTH: 0; TAVC: 0; TD: 0; TF: 0; TNBBE: 0; TNF: 0; TR: 0; TVBBE1: 0; TVBBE2: 0; VBBE: 0; VEF: 0; VER: 0; VO: 0; VREF: 0; VRT: 0; VTF: 0; WBE: 1; WSP: 1; XIKF: 0; XIN: 3; XIS: 3; XISR: 0; XRBI: 0; XRBP: 0; XRBX: 0; XRCI: 0; XRCX: 0; XRE: 0; XRS: 0; XTF: 0; XVO: 0; Supplier 1: Digikey; RoHS: Yes; Category: BJTs; Stock 1: 2318719; Pricing 1: 1=0.1, 10=0.068, 100=0.0369, 500=0.02898, 1000=0.02012 (USD); Number of Pins: 3; Package Shape: Rectangular; Terminal Finish: Tin; Transistor Element Material: SILICON; Max Operating Temperature: 150°C; JESD-609 Code: e3; Polarity/Channel Type: NPN; Collector-emitter Voltage-Max: 40V; JESD-30 Code: R-PDSO-G3; Moisture Sensitivity Level: 1; Number of Elements: 1; Package Style: SMALL OUTLINEMeter; Peak Reflow Temperature (Cel): 260°C; Surface Mount: Yes; Terminal Form: Gull Wing; Terminal Position: DUAL; Reach SVHC Compliant: Yes; RoHS Compliant: Yes; ComponentLink1URL: https://datasheet.ciiva.com:443/pdfs/VipMasterIC/IC/MCCC/MCCC-S-A0009373541/MCCC-S-A0009372855-1.pdf?src-supplier=IHS+Markit; ComponentLink1Description: https://datasheet.ciiva.com:443/pdfs/VipMasterIC/IC/MCCC/MCCC-S-A0009373541/MCCC-S-A0009372855-1.pdf?src-supplier=IHS+Markit; ComponentLink2URL: https://datasheet.ciiva.com/16291/mmbt3904sot-23-37005-16291911.pdf?src-supplier=Mouser; ComponentLink2Description: https://datasheet.ciiva.com/16291/mmbt3904sot-23-37005-16291911.pdf?src-supplier=Mouser; ComponentLink3URL: https://datasheet.ciiva.com/15139/getdatasheetpartid-251950-15139820.pdf?src-supplier=Verical; ComponentLink3Description: https://datasheet.ciiva.com/15139/getdatasheetpartid-251950-15139820.pdf?src-supplier=Verical; ComponentLink4URL: https://datasheet.ciiva.com/972/mmbt3904sot-23-972515.pdf?src-supplier=Digikey; ComponentLink4Description: https://datasheet.ciiva.com/972/mmbt3904sot-23-972515.pdf?src-supplier=Digikey; ComponentLink5URL: https://datasheet.ciiva.com/14546/70055699-14546053.pdf?src-supplier=Allied+Electronics; ComponentLink5Description: https://datasheet.ciiva.com/14546/70055699-14546053.pdf?src-supplier=Allied+Electronics; ComponentLink6URL: https://datasheet.ciiva.com/16742/mmbt3904tsot-523-16742101.pdf?src-supplier=Future+Electronics; ComponentLink6Description: https://datasheet.ciiva.com/16742/mmbt3904tsot-523-16742101.pdf?src-supplier=Future+Electronics; ComponentLink7URL: https://datasheet.ciiva.com/972/mmbt3904sot-23-972516.pdf?src-supplier=Digikey; ComponentLink7Description: https://datasheet.ciiva.com/972/mmbt3904sot-23-972516.pdf?src-supplier=Digikey
D? = 1N4148TR: MF: {'manufacturer': u'onsemi'}; Package: None; Price: None; Value: *; MP: 1N4148TR; Availability: Unavailable
J11-J13 = CMP-1502-01064-1: as J9 on sheet MCU; Manufacturer URL: http://www.we-online.de; Operating Temperature: -40to105degC; Packaging: Bag; Mounting Technology: THT; Package Reference: 61300411121; Datasheet URL: https://katalog.we-online.de/em/datasheet/6130xx11121.pdf; Publisher: WurthElektronik; Part Number: 61300411121; Row Number: Single; Orientation: Vertical
S1 = AZ943-1CH-5DE: Power/Signal Relay, 1 Form C, SPDT, Latched, 6.5VDC (Coil), 10A (Contact), 30VDC (Contact), DC Input, Random, AC/DC Output; Mfr_Name: American Zettler; Manufacturer Series: AZ943; End Contact Material: Tin; Coil Operate Voltage(DC): 3.8V; Coil Resistance: 70R; Coil Voltage(DC)-Max: 6.5V; Coil Voltage-Nom: 5V; Contact AC Max Power Rating R Load: 2770VA@277VAC; Contact AC Max Rating R Load: 10A@277VAC; Contact DC Max Power Rating R Load: 210W@30VDC; Contact DC Max Rating R Load: 10A@30VDC; Contact Resistance: 100mR; Contact Voltage(AC)-Max: 277V; Contact Voltage(DC)-Max: 30V; Dielectric Strength Between Coil and Contacts: 1500Vrms; Dielectric Strength Between Open Contacts: 750Vrms; Electrical Life: 100000Cycles; Operate Time: 10ms; PCB Hole Count: 5; Relay Form: 1 FORM C; Release Time: 5ms; Body Breadth: 15.49inch; Body Height: 15.95mm; Body Length or Diameter: 19.25mm; Reference Standard: UL; Sealing: EPOXY; Type: Power Relays; RefDes: RefDes; Supplier 1: Digikey; Manufacturer: American Zettler; Manufacturer Part Number: AZ943-1CH-5DE; RoHS: Yes; Category: Power Relays; Stock 1: 17823; Pricing 1: 1=0.95, 20=0.8865, 40=0.7485, 100=0.709, 260=0.63023, 500=0.59084, 1000=0.55146, 5000=0.53176 (USD); Number of Pins: 5; Terminal Finish: Tin; Weight: 10g; Min Operating Temperature: -40°C; Max Operating Temperature: 90°C; JESD-609 Code: e3; Coil/Input Supply Type: DC; Contact Current(AC)-Max: 10A; Contact Current(DC)-Max: 10A; Contact/Output Supply Type: AC/DC; Input Switching Control Type: Random; Insulation Resistance: 100MR; Relay Action: LATCHED; Relay Function: SPDT; Termination: Solder; Relay Type: POWER/SIGNAL RELAY; Terminal Length: 0.0035inch; Reach SVHC Compliant: Yes; RoHS Compliant: Yes; ComponentLink1URL: https://datasheet.ciiva.com:443/pdfs/VipMasterIC/IC/AMZI/AMZI-S-A0001423067/AMZI-S-A0001423092-1.pdf?src-supplier=IHS+Markit; ComponentLink1Description: https://datasheet.ciiva.com:443/pdfs/VipMasterIC/IC/AMZI/AMZI-S-A0001423067/AMZI-S-A0001423092-1.pdf?src-supplier=IHS+Markit; ComponentLink2URL: http://www.onlinecomponents.com/productFiles/mf-AZ/az943.pdf?src-supplier=Onlinecomponents.com; ComponentLink2Description: http://www.onlinecomponents.com/productFiles/mf-AZ/az943.pdf?src-supplier=Onlinecomponents.com; ComponentLink3URL: https://www.alliedelec.com/m/d/1c61ec61dea3d5294db531adeb7ad978.pdf?src-supplier=Allied+Electronics; ComponentLink3Description: https://www.alliedelec.com/m/d/1c61ec61dea3d5294db531adeb7ad978.pdf?src-supplier=Allied+Electronics; ComponentLink4URL: http://www.azettler.com/pdfs/az943.pdf?src-supplier=Future+Electronics; ComponentLink4Description: http://www.azettler.com/pdfs/az943.pdf?src-supplier=Future+Electronics

## Sheet Input.SchDoc
size A4; SheetNumber: 2; SheetTotal: 4
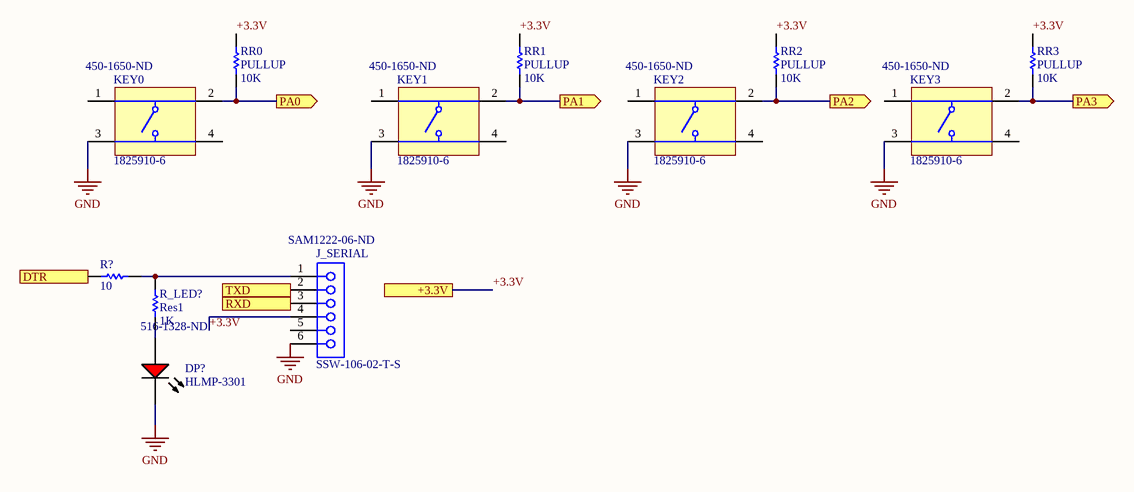
[diagram p3: Input.SchDoc]

### Parts
DP?  HLMP-3301  Supplier Part Number 1: 516-1328-ND  [AVAG-HLMP-3301-2]
J_SERIAL  SSW-106-02-T-S  Supplier Part Number 1: SAM1222-06-ND  [SMTC-SSW-106-02-X-S]
KEY0  1825910-6  Supplier Part Number 1: 450-1650-ND  [TECO-1825910-6_V]
KEY1  1825910-6  Supplier Part Number 1: 450-1650-ND  [TECO-1825910-6_V]
KEY2  1825910-6  Supplier Part Number 1: 450-1650-ND  [TECO-1825910-6_V]
KEY3  1825910-6  Supplier Part Number 1: 450-1650-ND  [TECO-1825910-6_V]
R?  10  [AXIAL-0.1-RES]
R_LED?  Res1  value 1K  [AXIAL-0.1-RES]
RR0  PULLUP  value 10K  [AXIAL-0.1-RES]
RR1  PULLUP  value 10K  [AXIAL-0.1-RES]
RR2  PULLUP  value 10K  [AXIAL-0.1-RES]
RR3  PULLUP  value 10K  [AXIAL-0.1-RES]

### Ports
+3.3V, DTR (out), PA0 (out), PA1 (out), PA2 (out), PA3 (out), RXD (in), TXD (out)

### Nets
GND: DP?.1(K) J_SERIAL.6 KEY0.3 KEY1.3 KEY2.3 KEY3.3
+3.3V: J_SERIAL.4 RR0.2 RR1.2 RR2.2 RR3.2 ; port +3.3V
DTR: R?.1 ; port DTR
PA0: KEY0.2 RR0.1 ; port PA0
PA1: KEY1.2 RR1.1 ; port PA1
PA2: KEY2.2 RR2.1 ; port PA2
PA3: KEY3.2 RR3.1 ; port PA3
RXD: J_SERIAL.3 ; port RXD
TXD: J_SERIAL.2 ; port TXD
NetDP?_2: DP?.2(A) R_LED?.1
NetJ_SERIAL_1: J_SERIAL.1 R?.2 R_LED?.2

Not connected (* = marked no-connect by the designer): J_SERIAL 5; KEY0 1 4; KEY1 1 4; KEY2 1 4; KEY3 1 4

### Library data of the parts
DP? = CMP-2000-06411-1: T-1 3/4 (5 mm) Diffused LED Lamp, 1.9 V, -40 to 100 degC, 2-Pin THD, RoHS, Bulk; Manufacturer: Avago; Forward Current: 25mA; Forward Voltage: 2.4V; Peak Wavelength: 635nm; Shape Type: Circular; High Brightness: No; Main Category: StandardLED; Test Current (It): 10mA; Dominant Wave Length: 626nm; Number of  Elements: 1; Reverse Voltage: 5V; Chip Material: GaP; Product Height (mm): 9.19mm; Lens Type: ColoredDiffused; Viewing Angle: 60deg; Emitting Color: Red; Luminous Intensity: 5.4mcd; Power Dissipation: 85W; DELETED: Compliant; Product Depth (mm): 6.1mm; Description: Single Color LED, High Efficiency Red, Tinted Diffused, T-1 3/4, 5mm; Shape: Round; Lens Style: Diffused,Tinted; Forward Current-Max: 30mA; Forward Voltage-Max: 3V; Luminous Intensity-Nom: 7mcd; Optoelectronic Device Type: SINGLE COLOR LED; T-code: T-1 3/4; Overall Height: 8.81mm; Package Description: 2-Pin Through Hole LED, Dia 5.85 mm; Mounting Technology: ThroughHole; Manufacturer URL: http://www.avagotech.com/; Package Type: T-13/4; Operating Temp Range: -40Cto100C; Datasheet URL: http://www.avagotech.com/docs/AV02-1558EN; Mounting: ThroughHole; Lens Dimensions: 5.08x5.08x8.3mm; Package Reference: HLMP-3301; Datasheet Version: 03/2015; Pin Count: 2; Packaging: TapeandReel; Type: Uni-Color; Operating Temperature Classification: Industrial; Lum Intensity: 5.4mcd; Rad Hardened: No; Product Length (mm): 6.1mm; Supplier 1: Digikey; Manufacturer Part Number: HLMP-3301; RoHS: Yes; Category: LEDs; Stock 1: 58393; Pricing 1: 1=0.46, 10=0.283, 100=0.1626, 1000=0.12726, 2000=0.11666, 6000=0.10605, 10000=0.09898, 26000=0.09545 (USD); Mount: Radial; Number of Pins: 2; Color: Red; Color@wavelength: Red; Terminal Finish: Tin; Min Operating Temperature: -55°C; Max Operating Temperature: 100°C; Number of Functions: 1; JESD-609 Code: e3; Size: 5mm; Terminal Pitch: 2.54mm; Reach SVHC Compliant: Yes; RoHS Compliant: Yes; ComponentLink1URL: https://datasheet.ciiva.com:443/pdfs/VipMasterIC/IC/AVGO/AVGOS05640/AVGOS05640-1.pdf?src-supplier=IHS+Markit; ComponentLink1Description: https://datasheet.ciiva.com:443/pdfs/VipMasterIC/IC/AVGO/AVGOS05640/AVGOS05640-1.pdf?src-supplier=IHS+Markit; ComponentLink2URL: https://datasheet.ciiva.com/14183/hlmp3x01-3507-eng-datasheet-14183876.pdf?src-supplier=Distrelec; ComponentLink2Description: https://datasheet.ciiva.com/14183/hlmp3x01-3507-eng-datasheet-14183876.pdf?src-supplier=Distrelec; ComponentLink3URL: https://datasheet.ciiva.com/1244/22186-1244722.pdf?src-supplier=Element14; ComponentLink3Description: https://datasheet.ciiva.com/1244/22186-1244722.pdf?src-supplier=Element14; ComponentLink4URL: https://datasheet.ciiva.com/11773/0900766b80026843-11773762.pdf?src-supplier=Rs; ComponentLink4Description: https://datasheet.ciiva.com/11773/0900766b80026843-11773762.pdf?src-supplier=Rs; ComponentLink5URL: https://datasheet.ciiva.com/15117/getdatasheetpartid-142345-15117743.pdf?src-supplier=Verical; ComponentLink5Description: https://datasheet.ciiva.com/15117/getdatasheetpartid-142345-15117743.pdf?src-supplier=Verical; ComponentLink6URL: https://datasheet.ciiva.com/29334/180620-da-01-en-led-5mm-hlmp-3301-rot-29334892.pdf?src-supplier=Conrad; ComponentLink6Description: https://datasheet.ciiva.com/29334/180620-da-01-en-led-5mm-hlmp-3301-rot-29334892.pdf?src-supplier=Conrad; ComponentLink7URL: https://datasheet.ciiva.com/14603/70157735-14603818.pdf?src-supplier=Allied+Electronics; ComponentLink7Description: https://datasheet.ciiva.com/14603/70157735-14603818.pdf?src-supplier=Allied+Electronics
J_SERIAL = CMP-1023-00360-1: SQ Post Socket, Through-hole, Vertical, -55 to 105 degC, 2.54mm Pitch, 6-Pin, Female, RoHS; Manufacturer: Samtec; Manufacturer Series: SSW-1; Description: Board Connector, 6 Contact(s), 1 Row(s), Female, Straight, 0.1 inch Pitch, Solder Terminal, Locking, Socket; Connector Type: BOARD CONNECTOR; Number of Rows Loaded: 1; Number of Contacts: 6; Contact Pattern: RECTANGULAR; Contact Style: SQ PIN-SKT; Option: General Purpose; Filter Feature: No; Additional Feature: TIGER BUY CONTACT; Mating Information: MULTIPLE MATING PARTS AVAILABLE; Mating Contact Pitch: 0.1inch; Body Breadth: 0.095inch; Body Length: 0.62inch; Mounting Option 1: LOCKING; Reference Standard: UL; Reliability: COMMERCIAL; ComponentLink1URL: http://www.samtec.com; Temperature Range: -55 to 105 degC; Pitch: 2.54 mm; Mounting Technology: Through-hole; DatasheetVersion: F-214; ComponentLink1Description: Manufacturer URL; PackageVersion: CA, 6/1987; ComponentLink3Description: Package Specification; PackageDescription: Assembly, Socket Strip .016 X .031 Tail; ComponentLink2Description: Datasheet; ComponentLink2URL: http://www.samtec.com/documents/webfiles/pdf/SSW_TH.PDF; PackageReference: SSW-106-02-X-S; ComponentLink3URL: http://www.samtec.com/documents/webfiles/cpdf/SSW-1XX-XX-XXX-X-XX-XXX-XX-MKT.pdf; RoHS: True; PartNumber: SSW-106-02-T-S; Orientation: Vertical; Supplier 1: Digikey; Manufacturer Part Number: SSW-106-02-T-S; Category: Connectors; Stock 1: 518; Pricing 1: 1=0.95, 10=0.8, 100=0.7186, 500=0.58794, 1000=0.52261, 5000=0.45729, 10000=0.43442 (USD); Mount: Board; Contact Finish - Termination: Matte Tin (Sn) - with Nickel (Ni) barrier; Contact Finish - Mating: MATTE TIN OVER NICKEL (50); Insulation Material: Polymer; Contact Material: Bronze; JESD-609 Code: e3; Contact Gender: Female; Mounting Style: STRAIGHT; Termination: Solder; Number Of Connectors: 1; Mixed Contacts: No; Number Of PCB Rows: 1; PCB Contact Pattern: RECTANGULAR; Body/Shell Style: SOCKET; Terminal Pitch: 2.54mm; Flammability Rating: UL94 V-0; Reach SVHC Compliant: Yes; RoHS Compliant: Yes; DIN Conformance: No; IEC Conformance: No; MIL Conformance: No; ComponentLink4URL: https://datasheet.ciiva.com:443/pdfs/VipMasterIC/IC/SAMI/SAMI-S-A0000099790/SAMI-S-A0001471334-1.pdf?src-supplier=IHS+Markit; ComponentLink4Description: https://datasheet.ciiva.com:443/pdfs/VipMasterIC/IC/SAMI/SAMI-S-A0000099790/SAMI-S-A0001471334-1.pdf?src-supplier=IHS+Markit; ComponentLink5URL: https://datasheet.ciiva.com/750/ssw-1xx-xx-xxx-x-xx-xxx-xx-mkt-750567.pdf?src-supplier=Digikey; ComponentLink5Description: https://datasheet.ciiva.com/750/ssw-1xx-xx-xxx-x-xx-xxx-xx-mkt-750567.pdf?src-supplier=Digikey
KEY0-KEY3 = CMP-1684-00021-1: Tact Switch, SPST-NO, 0.05 A, -35 to 85 degC, 4-Pin THD, RoHS, Bulk; Manufacturer: TE Connectivity; Maximum Contact Resistance: 100mOhm; Mechanical Life: 100000Cycles; Bushing Type: Unthreaded; Switch Configuration: OFF(ON); Maximum DC Voltage Rating: 24V; Contact Rating @ Voltage: 0.05A@24VDC; Actuator Color: Black; Body Orientation: Straight; Function: MomentaryContact; Illumination: N/R; Actuator Style: RoundButton; Actuator Material: PolybutyleneTerephthalate; Dielectric Strength: 500VAC; Pole Throw Configuration: SPST; Actuator Length: 1.4mm; Description: Keypad Switch, 1 Switches, SPST, Momentary-tactile, 0.05A, 24VDC, 2.06N, 4 PCB Hole Cnt, Solder Terminal, Through Hole-straight; Circuit Configuration: 1X1; Contact Current(DC)-Max: 50mA; Number of Switches: 1; Operating Force-Max: 2.06N; Switch Action: MOMENTARY; Switch Type: Keypad; Contact DC Max Rating R Load: .05A@24VDC; Body Breadth: 5.99inch; Body Height: 3.61mm; Body Length or Diameter: 5.99mm; Product Weight: N/A; Contact Material: CopperAlloy; Housing Material: N/A; Terminal Type: PCPins; Minimum Insulation Resistance: 100MOhm; Package Description: 4-Pin Through Hole Device, Body 5.99 x 5.99 mm, Pitch 6.5 mm; Part No: 1825910-6; Package Reference: THD; Base Material: N/A; Manufacturer URL: http://www.te.com; Contact Plating: Silver; RoHS: Yes; Datasheet Version: Rev. C9; Electrical Life: 100000Cycles; Maximum AC Voltage Rating: N/A; Thread Size: N/R; Operating Temperature: -35to85C; Mounting: ThroughHole; Dimension: 5.99x5mm; Datasheet URL: http://www.te.com/commerce/DocumentDelivery/DDEController?Action=showdoc&DocId=Customer+Drawing%7F1825910%7FC9%7Fpdf%7FEnglish%7FENG_CD_1825910_C9.pdf%7F1825910-6; Family: 1825910; Seal Location: N/A; Seal Description: N/A; Packaging: N/A; Supplier 1: Digikey; Manufacturer Part Number: 1825910-6; Category: Pushbutton Switches; Stock 1: 59562; Pricing 1: 1=0.13, 10=0.125, 25=0.1184, 100=0.1078, 250=0.10132, 500=0.09268, 1000=0.07759, 2500=0.07544, 5000=0.07113 (USD); Mount: Through Hole; Min Operating Temperature: -35°C; Max Operating Temperature: 85°C; Termination: Solder; Contact Voltage(DC)-Max: 24V; Switch Function: SPST; Reach SVHC Compliant: Yes; RoHS Compliant: Yes; ComponentLink1URL: https://datasheet.ciiva.com:443/pdfs/VipMasterIC/IC/TYEL/TYEL-S-A0008869674/TYEL-S-A0008850909-1.pdf?src-supplier=IHS+Markit; ComponentLink1Description: https://datasheet.ciiva.com:443/pdfs/VipMasterIC/IC/TYEL/TYEL-S-A0008869674/TYEL-S-A0008850909-1.pdf?src-supplier=IHS+Markit
R? = RES 10 OHM 5% 1/4W AXIAL: Resistor; Manufacturer Part Number: CFR-25JB-52-10R; Designator: R?; Power Rating: 1/4W; Tolerance: 0.05; Published: 8-Jun-2000; LatestRevisionDate: 17-Jul-2002; LatestRevisionNote: Re-released for DXP Platform.; Publisher: Altium Limited
R_LED? = RES 1K OHM 5% 1/4W AXIAL: as R_LED1 on sheet MCU; Published: 8-Jun-2000; LatestRevisionDate: 17-Jul-2002; LatestRevisionNote: Re-released for DXP Platform.; Publisher: Altium Limited
RR0-RR3 = RES 10K OHM 5% 1/4W AXIAL: as RRS on sheet MCU; Published: 8-Jun-2000; LatestRevisionDate: 17-Jul-2002; LatestRevisionNote: Re-released for DXP Platform.; Publisher: Altium Limited

## Nets that join several sheets
GND: MCU (11 pins), Output (7 pins), Switch (6 pins), Input (6 pins)
+3.3V: MCU (8 pins), Output (5 pins), Input (5 pins)
DTR: MCU (U_MCU.16), Input (R?.1)
LO_F1_0: MCU (J9.2), Output (J_PLL.7)
LO_F1_90: MCU (J9.3), Output (J_PLL.6)
LO_F2: MCU (J10.1), Output (J_PLL.5)
PA0: MCU (U_MCU.40), Input (KEY0.2 RR0.1)
PA1: MCU (U_MCU.39), Input (KEY1.2 RR1.1)
PA2: MCU (U_MCU.38), Input (KEY2.2 RR2.1)
PA3: MCU (U_MCU.37), Input (KEY3.2 RR3.1)
RST: MCU (J_JTAG.6 RRS.1 SW_RST.2 U_MCU.9), Output (LCD1.20)
RXD: MCU (U_MCU.15), Input (J_SERIAL.3)
SCL: MCU (U_MCU.22), Output (J_PLL.4 LCD1.17 RP2.1 TP_SCL.1)
SDA: MCU (U_MCU.23), Output (5 pins)
TXD: MCU (U_MCU.14), Input (J_SERIAL.2)